# Altium project SC940D.PrjPcb (part 2 of 2)

## Sheet SC940D_STORRM.SchDoc: Sorties TOR Relais Monostable
size 393 x 270 mm; CompanyName: Seccom; Address1: 521, rue du capt. François Garbit; Address2: 69440 Mornant; Address3: seccom@seccom.fr; Address4: www.seccom.fr; DocumentNumber: 5; SheetNumber: 5; SheetTotal: 8; PageSetup: Record=PageOptions|CenterHorizontal=True|CenterVertical=True|PrintScale=0.74|XCorrection=1.00|YCorrection=1.00|PrintKind=0|BorderSize=5000000|LeftOffset=0|BottomOffset=0|Orientation=2|PaperLength=1000|PaperWidth=1000|Scale=100|PaperSource=7|PrintQuality=-4|MediaType=1|DitherType=10|PaperKind=A4|PrintScaleMode=1
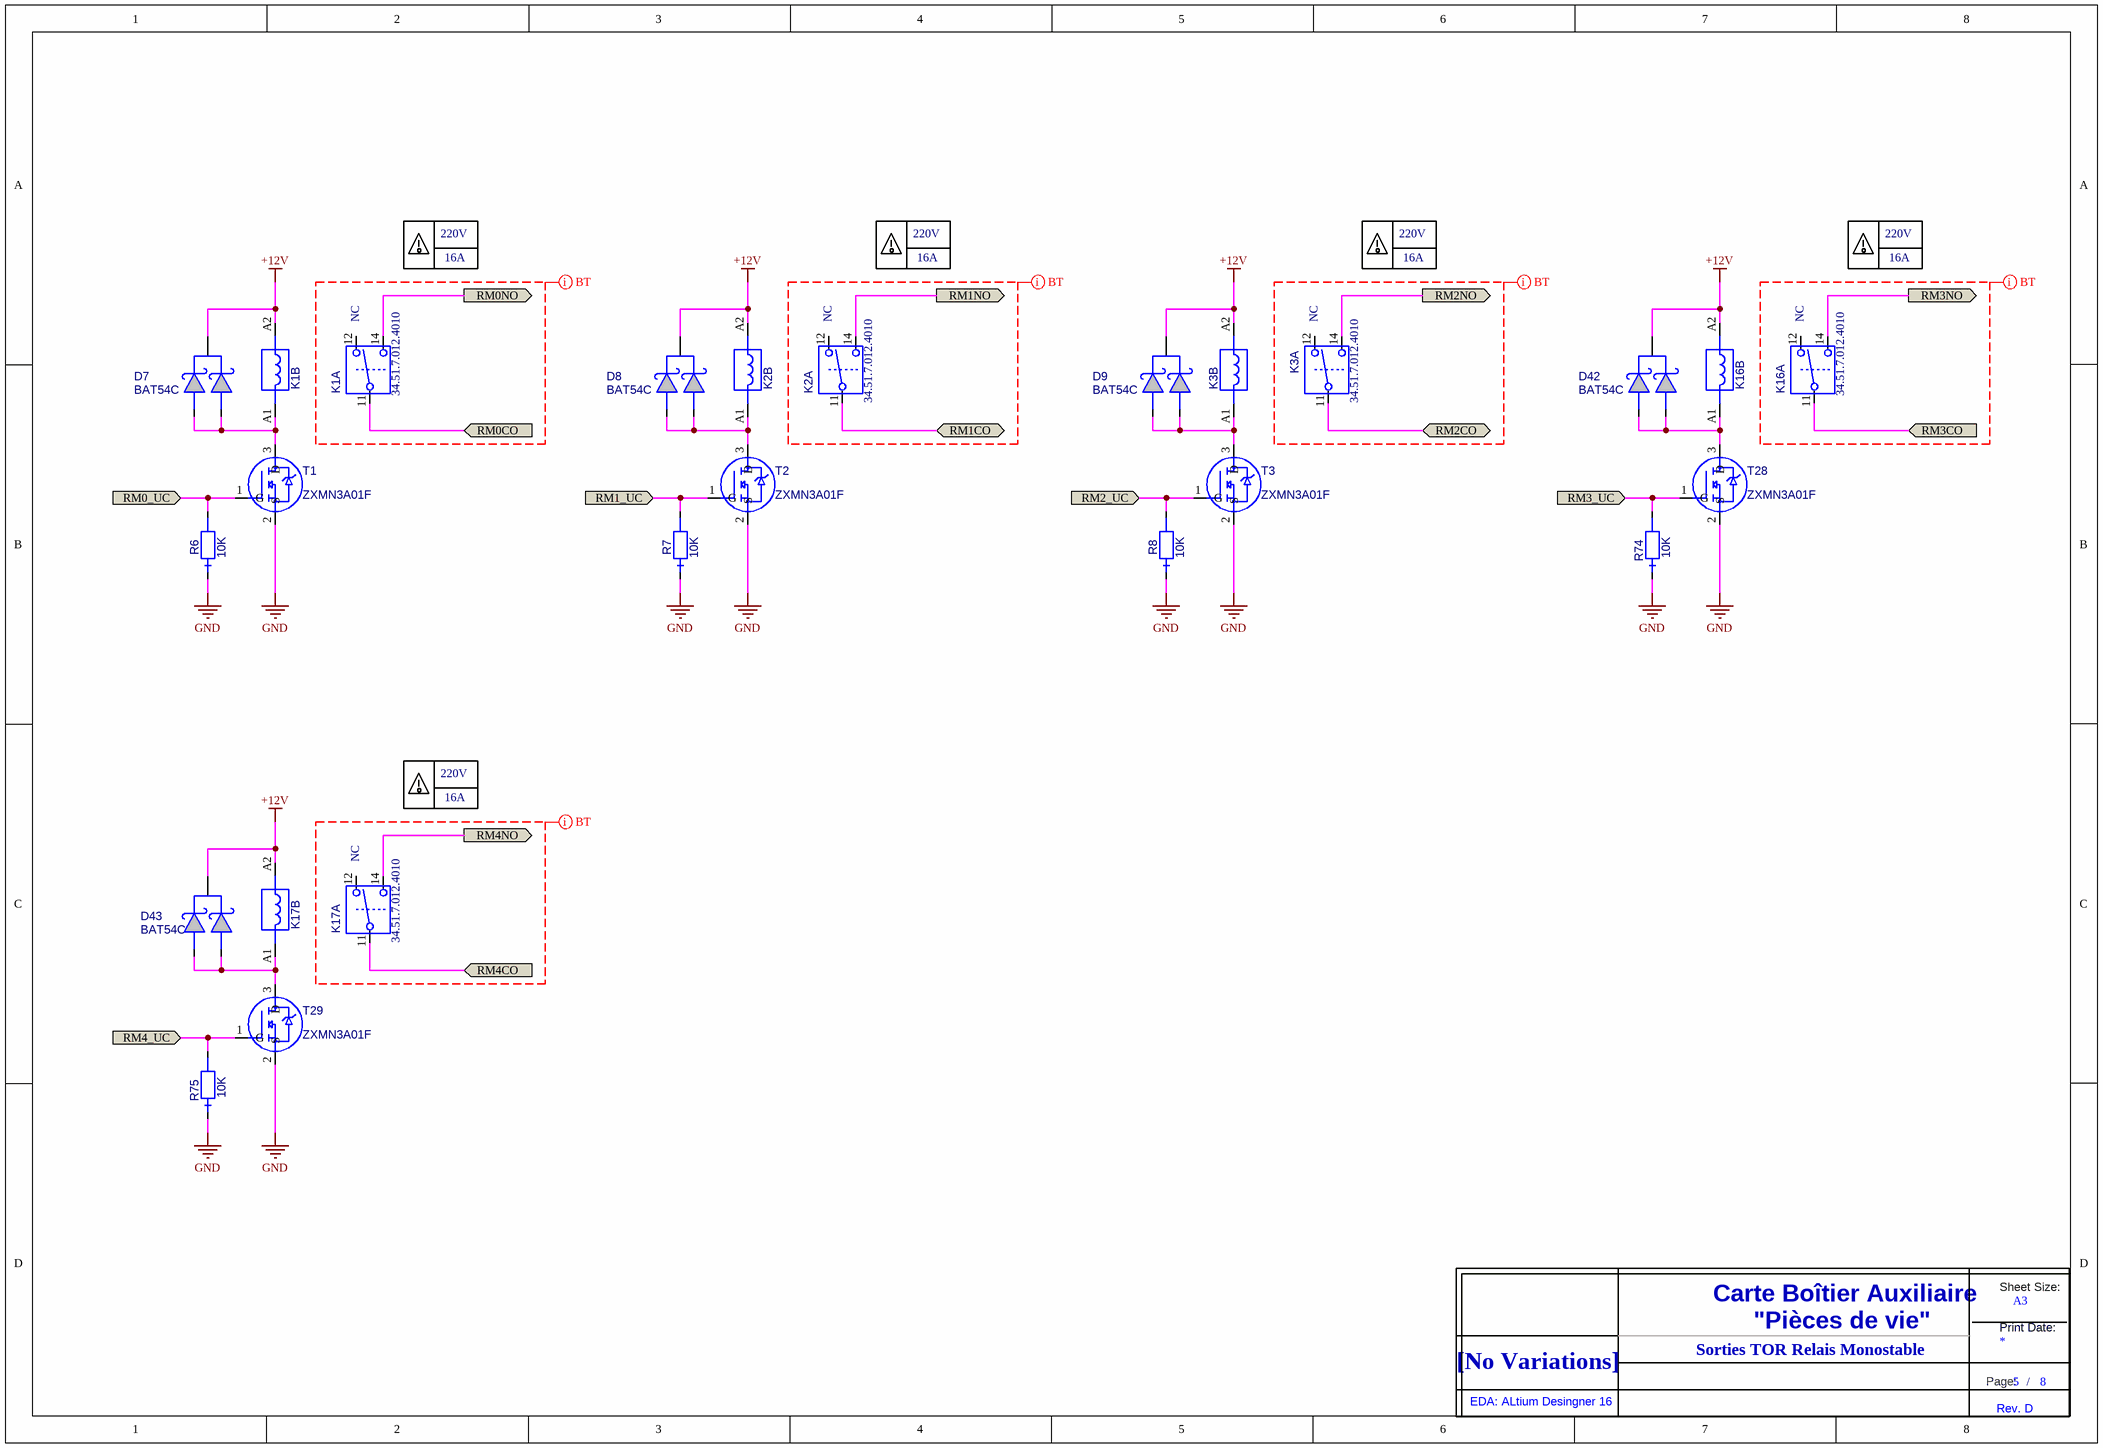
[diagram p5: SC940D_STORRM.SchDoc]

### Parts
(Parts that share a designator on the sheet are numbered #1, #2 ... from top to bottom, then left to right.)
D7  BAT54C  [SOT23_3L_ReflowSoldering]
D8  BAT54C  [SOT23_3L_ReflowSoldering]
D9  BAT54C  [SOT23_3L_ReflowSoldering]
D42  BAT54C  [SOT23_3L_ReflowSoldering]
D43  BAT54C  [SOT23_3L_ReflowSoldering]
K1  value 34.51.7.012.4010  [RELAY_FINDER_34.51_+SUPPORT_93]  (hidden comment: RELAY_12VDC_1RT_34.51)  (parts A,B of 2)
K2  RELAY_12VDC_1RT_34.51  [RELAY_FINDER_34.51_+SUPPORT_93]  (value not drawn)  (parts A,B of 2)
K3  value 34.51.7.012.4010  [RELAY_FINDER_34.51_+SUPPORT_93]  (hidden comment: RELAY_12VDC_1RT_34.51)  (parts A,B of 2)
K16  RELAY_12VDC_1RT_34.51  [RELAY_FINDER_34.51_+SUPPORT_93]  (value not drawn)  (parts A,B of 2)
K17  value 34.51.7.012.4010  [RELAY_FINDER_34.51_+SUPPORT_93]  (hidden comment: RELAY_12VDC_1RT_34.51)  (parts A,B of 2)
R6  value 10K  [0805_ReflowSoldering_RES]  (hidden comment: RES_0805_1%_100PPM_10K)
R7  value 10K  [0805_ReflowSoldering_RES]  (hidden comment: RES_0805_1%_100PPM_10K)
R8  value 10K  [0805_ReflowSoldering_RES]  (hidden comment: RES_0805_1%_100PPM_10K)
R74  value 10K  [0805_ReflowSoldering_RES]  (hidden comment: RES_0805_1%_100PPM_10K)
R75  value 10K  [0805_ReflowSoldering_RES]  (hidden comment: RES_0805_1%_100PPM_10K)
T1  ZXMN3A01F  [SOT23_3L_ReflowSoldering]
T2  ZXMN3A01F  [SOT23_3L_ReflowSoldering]
T3  ZXMN3A01F  [SOT23_3L_ReflowSoldering]
T28  ZXMN3A01F  [SOT23_3L_ReflowSoldering]
T29  ZXMN3A01F  [SOT23_3L_ReflowSoldering]
Title_new#5  DNI  (value not drawn)  (graphical)

### Ports
RM0_UC (in), RM0CO (in), RM0NO (out), RM1_UC (in), RM1CO, RM1NO (out), RM2_UC (in), RM2CO, RM2NO (out), RM3_UC (in), RM3CO (in), RM3NO (out), RM4_UC (in), RM4CO (in), RM4NO (out)

### Nets
+12V: D7.3 D8.3 D9.3 D42.3 D43.3 K1.A2 K2.A2 K3.A2 K16.A2 K17.A2
GND: R6.1 R7.1 R8.1 R74.1 R75.1 T1.2(S) T2.2(S) T3.2(S) T28.2(S) T29.2(S)
RM0_UC: R6.2 T1.1(G) ; port RM0_UC
RM0CO: K1.11(COM) ; port RM0CO
RM0NO: K1.14(NO) ; port RM0NO
RM1_UC: R7.2 T2.1(G) ; port RM1_UC
RM1CO: K2.11(COM) K3.11(COM) ; port RM1CO, port RM2CO
RM1NO: K2.14(NO) ; port RM1NO
RM2_UC: R8.2 T3.1(G) ; port RM2_UC
RM2NO: K3.14(NO) ; port RM2NO
RM3_UC: R74.2 T28.1(G) ; port RM3_UC
RM3CO: K16.11(COM) ; port RM3CO
RM3NO: K16.14(NO) ; port RM3NO
RM4_UC: R75.2 T29.1(G) ; port RM4_UC
RM4CO: K17.11(COM) ; port RM4CO
RM4NO: K17.14(NO) ; port RM4NO
NetD7_1: D7.1 D7.2 K1.A1 T1.3(D)
NetD8_1: D8.1 D8.2 K2.A1 T2.3(D)
NetD9_1: D9.1 D9.2 K3.A1 T3.3(D)
NetD42_1: D42.1 D42.2 K16.A1 T28.3(D)
NetD43_1: D43.1 D43.2 K17.A1 T29.3(D)

Not connected (* = marked no-connect by the designer): K1 12(NC); K2 12(NC); K3 12(NC); K16 12(NC); K17 12(NC)

### Layout directives
net class BT: (no net found under the mark)

### Notes on the sheet
- 220V
- (near K1) NC
- 16A
- (near K2) NC
- (near K3) NC
- (near K16) NC
- (near K17) NC
- Sorties TOR Relais Monostable
- (in symbol Title_new) Sheet Size:; Carte Boîtier Auxiliaire; A3; "Pièces de vie"; Print Date:; [No Variations]; Page:; /; EDA: ALtium Desingner 16; Rev. D

### Library data of the parts
D7-D9 D42 D43 = BAT54C: Diode Schottky double, BAT54 cathode com, Vrrm=30V, If=300mA, Vf=0.4Vmax, CMS; Creation: LJ (14/05/02); Reference: 000597/00; Boitier: SOT23_3L; Remarque: {Remarque}; Fabricant: NXP; Coeff: 1; Verification: LJ (14/05/02); Ref Fab: BAT54C; ComponentLink1URL: o:\_Documentation\Datasheets\NXP\BAT54_series.pdf; ComponentLink2URL: o:\_Documentation\Datasheets\_BOITIERS\ACTIF_CMS\SOT\SOT_23_3P_(Schneider).PDF; Config: *; ComponentLink1Description: Datasheet; ComponentLink2Description: Datasheet Boitier; Value: BAT54C; Supplier 1: Farnell; Supplier Part Number 1: 1081192
K1 K3 K17 = RELAY_12VDC_1RT_34.51: Relais 1RT, 12Vdc, série 34.51, Rc=1940R, Sw:250Vac/6A, Ron=? (AgSnO2); Creation: CHD; Verification: LJ (24/11/11); Boitier: DIP12 Form C; Remarque: {Remarque}; Fabricant: Finder; Coeff: 1; Ref Fab: 34.51.7.012.4010; ComponentLink1URL: o:\_Documentation\Datasheets\Finder\Relais_Serie_34.pdf; ComponentLink2URL: o:\_Documentation\Datasheets\_BOITIERS\; Config: *; ComponentLink1Description: Datasheet; ComponentLink2Description: Datasheet Boitier
K2 K16 = RELAY_12VDC_1RT_34.51: Relais 1RT, 12Vdc, série 34.51, Rc=1940R, Sw:250Vac/6A, Ron=? (AgSnO2); Creation: CHD; Verification: LJ (24/11/11); Boitier: DIP12 Form C; Remarque: {Remarque}; Fabricant: Finder; Ref Fab: 34.51.7.012.4010; Coeff: 1; Value: 34.51.7.012.4010; ComponentLink1URL: o:\_Documentation\Datasheets\Finder\Relais_Serie_34.pdf; ComponentLink2URL: o:\_Documentation\Datasheets\_BOITIERS\; Config: *; ComponentLink1Description: Datasheet; ComponentLink2Description: Datasheet Boitier
R6-R8 R74 R75 = RES_0805_1%_100PPM_10K: Résistance CMS 0805, 0.125W, 1%, 100ppm, 150V; Creation: LJ (06/02/09); Reference: 000063/00; Boitier: 0805; Remarque: {Remarque}; Fabricant: Yageo; Ref Fab: RC0805FR-0710KL; Coeff: 1; Verification: *; ComponentLink1URL: o:\_Documentation\Datasheets\BC_Components\Resistances_ThickFilmFlatChip_0402-0603-0805-1206.pdf; ComponentLink2URL: o:\_Documentation\Datasheets\_BOITIERS\PASSIF_CMS\RC_0805_(2x1,25)_(Schneider).PDF; Config: *; ComponentLink1Description: Datasheet; ComponentLink2Description: Datasheet Boitier; Supplier 1: Farnell; Supplier Part Number 1: 9237755
T1-T3 T28 T29 = ZXMN3A01F: Transistor MOSN logique, Vdss=30V, Id=2A, Rdson=0.12R, CMS; Boitier: SOT23_3L; Remarque: {Remarque}; Creation: CHD; Fabricant: Zetex; Coeff: 1; Ref Fab: ZXMN3A01F; ComponentLink1URL: o:\_Documentation\Datasheets\; ComponentLink2URL: o:\_Documentation\Datasheets\_BOITIERS\ACTIF_CMS\SOT\SOT_23_3P_(Schneider).PDF; Config: *; ComponentLink1Description: Datasheet; Value: ZXMN3A01F; Supplier 1: Farnell; Supplier 2: Mouser; Supplier Part Number 1: 9525734; Supplier Part Number 2: 522-ZXMN3A01FTA
Title_new#5 = Title_new

## Sheet SC940D_Variateurs.SchDoc: Variateurs
size 393 x 270 mm; CompanyName: Seccom; Address1: 521, rue du capt. François Garbit; Address2: 69440 Mornant; Address3: seccom@seccom.fr; Address4: www.seccom.fr; DocumentNumber: 6; SheetNumber: 6; SheetTotal: 8; PageSetup: Record=PageOptions|CenterHorizontal=True|CenterVertical=True|PrintScale=0.74|XCorrection=1.00|YCorrection=1.00|PrintKind=0|BorderSize=5000000|LeftOffset=0|BottomOffset=0|Orientation=2|PaperLength=1000|PaperWidth=1000|Scale=100|PaperSource=7|PrintQuality=-4|MediaType=1|DitherType=10|PaperKind=A4|PrintScaleMode=1
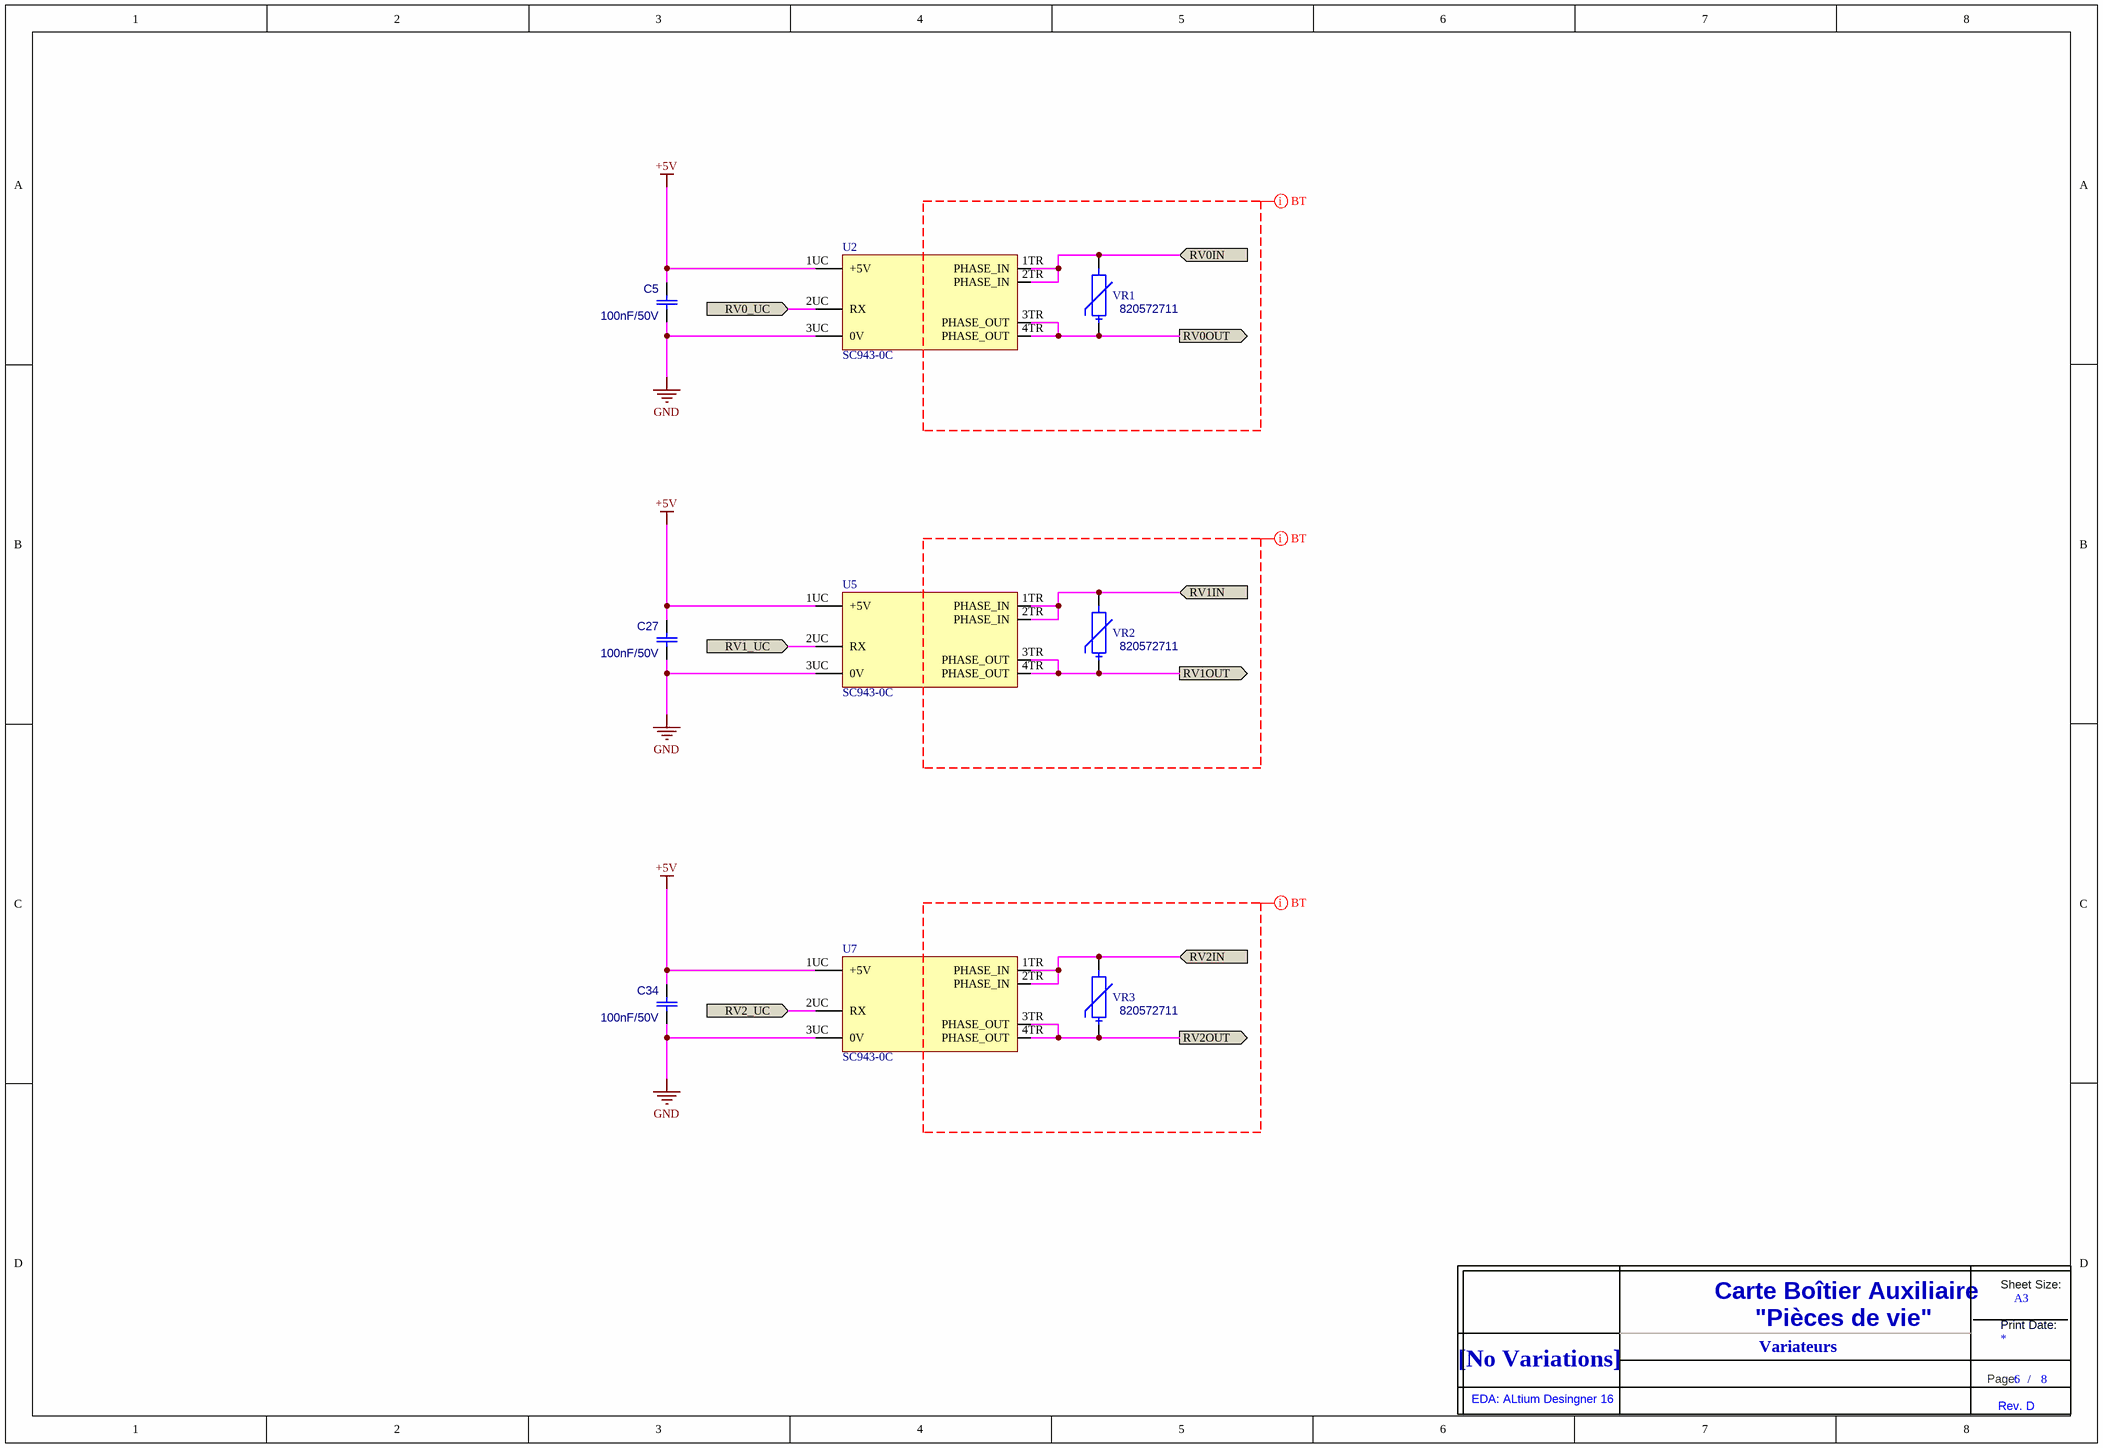
[diagram p6: SC940D_Variateurs.SchDoc]

### Parts
(Parts that share a designator on the sheet are numbered #1, #2 ... from top to bottom, then left to right.)
C5  value 100nF/50V  [0805_ReflowSoldering_CAP]  (hidden comment: C_0805_X7R_10%_100N-50V)
C27  value 100nF/50V  [0805_ReflowSoldering_CAP]  (hidden comment: C_0805_X7R_10%_100N-50V)
C34  value 100nF/50V  [0805_ReflowSoldering_CAP]  (hidden comment: C_0805_X7R_10%_100N-50V)
Title_new#6  DNI  (value not drawn)  (graphical)
U2  SC943-0C  [SI943C_REV_A]
U5  SC943-0C  [SI943C_REV_A]
U7  SC943-0C  [SI943C_REV_A]
VR1  value 820572711  [VDR_Serie_820_d7_h13_e5mm]  (hidden comment: VDR_820572711)
VR2  value 820572711  [VDR_Serie_820_d7_h13_e5mm]  (hidden comment: VDR_820572711)
VR3  value 820572711  [VDR_Serie_820_d7_h13_e5mm]  (hidden comment: VDR_820572711)

### Ports
RV0_UC (in), RV0IN (in), RV0OUT (out), RV1_UC (in), RV1IN (in), RV1OUT (out), RV2_UC (in), RV2IN (in), RV2OUT (out)

### Nets
+5V: C5.1 C27.1 C34.1 U2.1UC(+5V) U5.1UC(+5V) U7.1UC(+5V)
GND: C5.2 C27.2 C34.2 U2.3UC(0V) U5.3UC(0V) U7.3UC(0V)
RV0_UC: U2.2UC(RX) ; port RV0_UC
RV0IN: U2.1TR(PHASE_IN) U2.2TR(PHASE_IN) VR1.2 ; port RV0IN
RV0OUT: U2.3TR(PHASE_OUT) U2.4TR(PHASE_OUT) VR1.1 ; port RV0OUT
RV1_UC: U5.2UC(RX) ; port RV1_UC
RV1IN: U5.1TR(PHASE_IN) U5.2TR(PHASE_IN) VR2.2 ; port RV1IN
RV1OUT: U5.3TR(PHASE_OUT) U5.4TR(PHASE_OUT) VR2.1 ; port RV1OUT
RV2_UC: U7.2UC(RX) ; port RV2_UC
RV2IN: U7.1TR(PHASE_IN) U7.2TR(PHASE_IN) VR3.2 ; port RV2IN
RV2OUT: U7.3TR(PHASE_OUT) U7.4TR(PHASE_OUT) VR3.1 ; port RV2OUT

### Layout directives
net class BT: (no net found under the mark)

### Notes on the sheet
- Variateurs
- (in symbol Title_new) Sheet Size:; Carte Boîtier Auxiliaire; A3; "Pièces de vie"; Print Date:; [No Variations]; Page:; /; EDA: ALtium Desingner 16; Rev. D

### Library data of the parts
C5 C27 C34 = C_0805_X7R_10%_100N-50V: Condensateur céramique, X7R, 10%, CMS 0805; Creation: LJ; Verification: LJ (28/05/04); Reference: 000042/00; Boitier: 0805; Remarque: {Remarque}; Fabricant: AVX; Ref Fab: 08055C104KAT2A; Coeff: 1; ComponentLink1URL: o:\_Documentation\Datasheets\BC_Components\Condo_CMS_NPO-X7R-Y5V.pdf; ComponentLink2URL: o:\_Documentation\Datasheets\_BOITIERS\PASSIF_CMS\RC_0805_(2x1,25)_(Schneider).PDF; Config: *; ComponentLink1Description: Datasheet; ComponentLink2Description: Datasheet Boitier; Supplier 1: Farnell; Supplier Part Number 1: 499687
Title_new#6 = Title_new
U2 U5 U7 = SC943-0C: Carte gradateur; Boitier: SI943C; Coeff: 1; Fabricant: Valentinéa; Remarque: {Remarque}; Ref Fab: SC943-0C; Value: SC943-0C
VR1-VR3 = VDR_820572711: Varistance disque 275Vac, 350Vdc, 33J, Vbreak=430V@1mA, Vclamp=710V@10A, Ipeak=1200A; Creation: LJ (12/01/12); Reference: {Reference}; Boitier: d7_t4.6_h13_e5mm; Remarque: {Remarque}; Fabricant: Wurth Elektronik; Coeff: 1; Ref Fab: 820572711; ComponentLink1URL: o:\_Documentation\Datasheets\Wurth_Elektronik\Varistance_820572711.pdf; ComponentLink2URL: o:\_Documentation\Datasheets\; Config: *; ComponentLink1Description: Datasheet; ComponentLink2Description: Datasheet Boitier

## Sheet SC940D_STORRB.SchDoc: Sorties TOR Relais Bistable
size 393 x 270 mm; CompanyName: Seccom; Address1: 521, rue du capt. François Garbit; Address2: 69440 Mornant; Address3: seccom@seccom.fr; Address4: www.seccom.fr; DocumentNumber: 7; SheetNumber: 7; SheetTotal: 8; PageSetup: Record=PageOptions|CenterHorizontal=True|CenterVertical=True|PrintScale=0.74|XCorrection=1.00|YCorrection=1.00|PrintKind=0|BorderSize=5000000|LeftOffset=0|BottomOffset=0|Orientation=2|PaperLength=1000|PaperWidth=1000|Scale=100|PaperSource=7|PrintQuality=-4|MediaType=1|DitherType=10|PaperKind=A4|PrintScaleMode=1
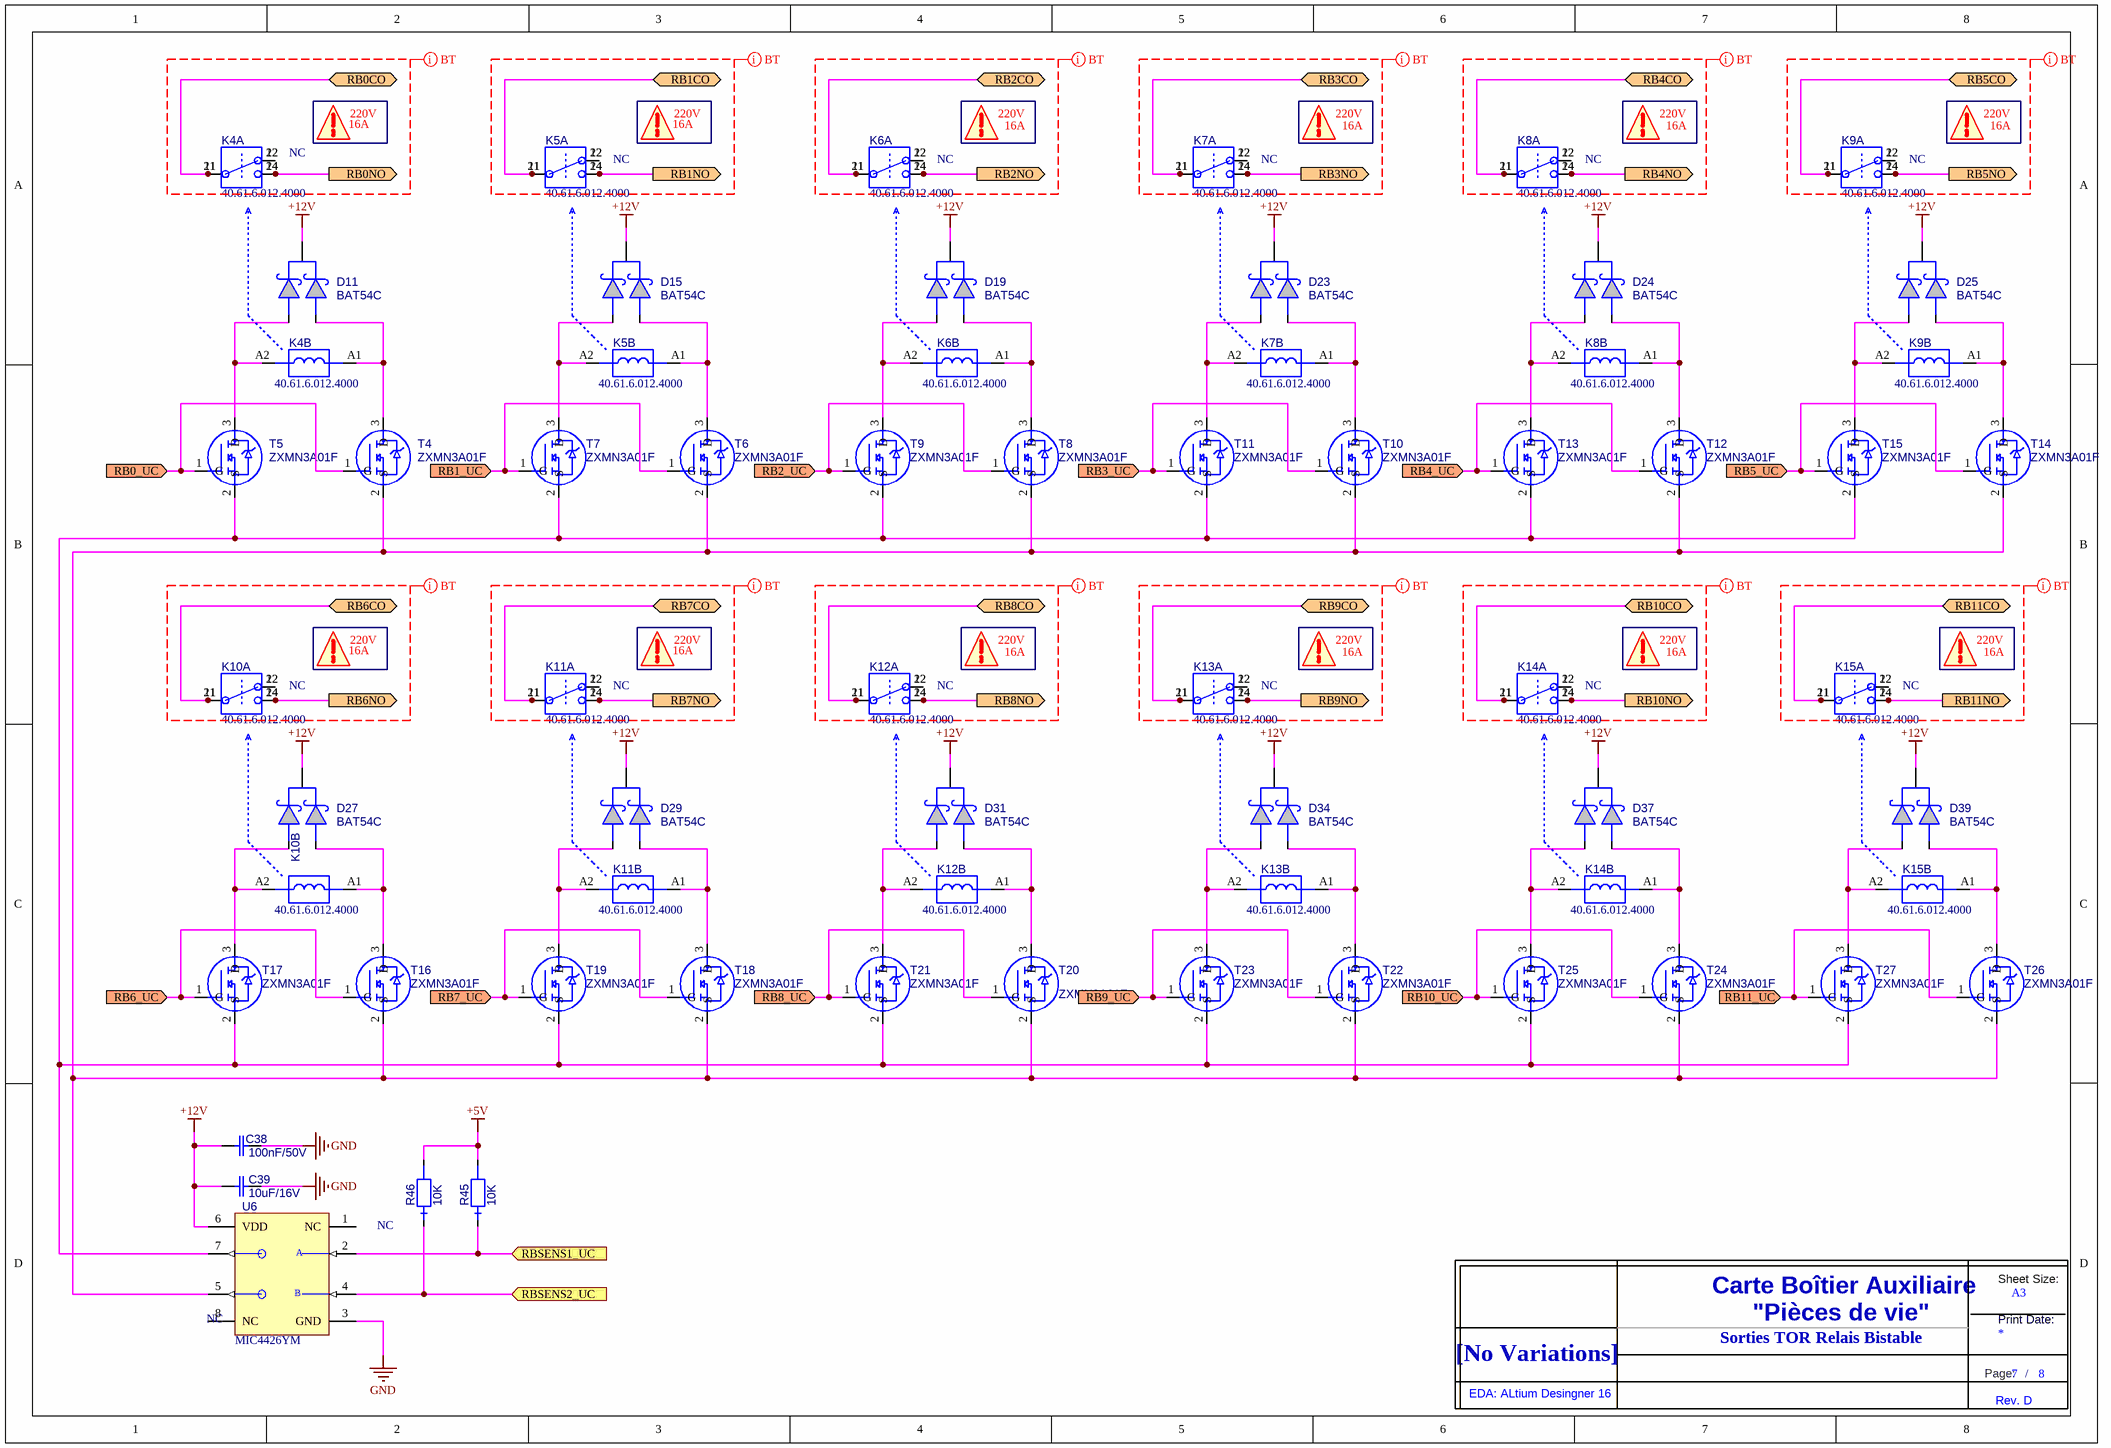
[diagram p7: SC940D_STORRB.SchDoc]

### Parts
(Parts that share a designator on the sheet are numbered #1, #2 ... from top to bottom, then left to right.)
C38  value 100nF/50V  [0805_ReflowSoldering_CAP]  (hidden comment: C_0805_X7R_10%_100N-50V)
C39  value 10uF/16V  [0805_ReflowSoldering_CAP]  (hidden comment: C_0805_X5R_10%_10U-16V)
D11  BAT54C  [SOT23_3L_ReflowSoldering]
D15  BAT54C  [SOT23_3L_ReflowSoldering]
D19  BAT54C  [SOT23_3L_ReflowSoldering]
D23  BAT54C  [SOT23_3L_ReflowSoldering]
D24  BAT54C  [SOT23_3L_ReflowSoldering]
D25  BAT54C  [SOT23_3L_ReflowSoldering]
D27  BAT54C  [SOT23_3L_ReflowSoldering]
D29  BAT54C  [SOT23_3L_ReflowSoldering]
D31  BAT54C  [SOT23_3L_ReflowSoldering]
D34  BAT54C  [SOT23_3L_ReflowSoldering]
D37  BAT54C  [SOT23_3L_ReflowSoldering]
D39  BAT54C  [SOT23_3L_ReflowSoldering]
K4  value 40.61.6.012.4000  [RELAY_FINDER_40.61_+SUPPORT_95]  (hidden comment: RELAY_12VDC_1RT_BI_40.61.6)  (parts A,B of 2)
K5  value 40.61.6.012.4000  [RELAY_FINDER_40.61_+SUPPORT_95]  (hidden comment: RELAY_12VDC_1RT_BI_40.61.6)  (parts A,B of 2)
K6  value 40.61.6.012.4000  [RELAY_FINDER_40.61_+SUPPORT_95]  (hidden comment: RELAY_12VDC_1RT_BI_40.61.6)  (parts A,B of 2)
K7  value 40.61.6.012.4000  [RELAY_FINDER_40.61_+SUPPORT_95]  (hidden comment: RELAY_12VDC_1RT_BI_40.61.6)  (parts A,B of 2)
K8  value 40.61.6.012.4000  [RELAY_FINDER_40.61_+SUPPORT_95]  (hidden comment: RELAY_12VDC_1RT_BI_40.61.6)  (parts A,B of 2)
K9  value 40.61.6.012.4000  [RELAY_FINDER_40.61_+SUPPORT_95]  (hidden comment: RELAY_12VDC_1RT_BI_40.61.6)  (parts A,B of 2)
K10  value 40.61.6.012.4000  [RELAY_FINDER_40.61_+SUPPORT_95]  (hidden comment: RELAY_12VDC_1RT_BI_40.61.6)  (parts A,B of 2)
K11  value 40.61.6.012.4000  [RELAY_FINDER_40.61_+SUPPORT_95]  (hidden comment: RELAY_12VDC_1RT_BI_40.61.6)  (parts A,B of 2)
K12  value 40.61.6.012.4000  [RELAY_FINDER_40.61_+SUPPORT_95]  (hidden comment: RELAY_12VDC_1RT_BI_40.61.6)  (parts A,B of 2)
K13  value 40.61.6.012.4000  [RELAY_FINDER_40.61_+SUPPORT_95]  (hidden comment: RELAY_12VDC_1RT_BI_40.61.6)  (parts A,B of 2)
K14  value 40.61.6.012.4000  [RELAY_FINDER_40.61_+SUPPORT_95]  (hidden comment: RELAY_12VDC_1RT_BI_40.61.6)  (parts A,B of 2)
K15  value 40.61.6.012.4000  [RELAY_FINDER_40.61_+SUPPORT_95]  (hidden comment: RELAY_12VDC_1RT_BI_40.61.6)  (parts A,B of 2)
R45  value 10K  [0805_ReflowSoldering_RES]  (hidden comment: RES_0805_1%_100PPM_10K)
R46  value 10K  [0805_ReflowSoldering_RES]  (hidden comment: RES_0805_1%_100PPM_10K)
T4  ZXMN3A01F  [SOT23_3L_ReflowSoldering]
T5  ZXMN3A01F  [SOT23_3L_ReflowSoldering]
T6  ZXMN3A01F  [SOT23_3L_ReflowSoldering]
T7  ZXMN3A01F  [SOT23_3L_ReflowSoldering]
T8  ZXMN3A01F  [SOT23_3L_ReflowSoldering]
T9  ZXMN3A01F  [SOT23_3L_ReflowSoldering]
T10  ZXMN3A01F  [SOT23_3L_ReflowSoldering]
T11  ZXMN3A01F  [SOT23_3L_ReflowSoldering]
T12  ZXMN3A01F  [SOT23_3L_ReflowSoldering]
T13  ZXMN3A01F  [SOT23_3L_ReflowSoldering]
T14  ZXMN3A01F  [SOT23_3L_ReflowSoldering]
T15  ZXMN3A01F  [SOT23_3L_ReflowSoldering]
T16  ZXMN3A01F  [SOT23_3L_ReflowSoldering]
T17  ZXMN3A01F  [SOT23_3L_ReflowSoldering]
T18  ZXMN3A01F  [SOT23_3L_ReflowSoldering]
T19  ZXMN3A01F  [SOT23_3L_ReflowSoldering]
T20  ZXMN3A01F  [SOT23_3L_ReflowSoldering]
T21  ZXMN3A01F  [SOT23_3L_ReflowSoldering]
T22  ZXMN3A01F  [SOT23_3L_ReflowSoldering]
T23  ZXMN3A01F  [SOT23_3L_ReflowSoldering]
T24  ZXMN3A01F  [SOT23_3L_ReflowSoldering]
T25  ZXMN3A01F  [SOT23_3L_ReflowSoldering]
T26  ZXMN3A01F  [SOT23_3L_ReflowSoldering]
T27  ZXMN3A01F  [SOT23_3L_ReflowSoldering]
Title_new#7  DNI  (value not drawn)  (graphical)
U6  MIC4426YM  [SOIC_08_E1,27_L150_ReflowSoldering]

### Ports
RB0_UC (in), RB0CO, RB0NO (out), RB1_UC (in), RB1CO, RB1NO (out), RB2_UC (in), RB2CO, RB2NO (out), RB3_UC (in), RB3CO, RB3NO (out), RB4_UC (in), RB4CO, RB4NO (out), RB5_UC (in), RB5CO, RB5NO (out), RB6_UC (in), RB6CO, RB6NO (out), RB7_UC (in), RB7CO, RB7NO (out), RB8_UC (in), RB8CO, RB8NO (out), RB9_UC (in), RB9CO, RB9NO (out), RB10_UC (in), RB10CO, RB10NO (out), RB11_UC (in), RB11CO, RB11NO (out), RBSENS1_UC (in), RBSENS2_UC (in)

### Nets
+5V: R45.2 R46.2
+12V: C38.1 C39.2 D11.3 D15.3 D19.3 D23.3 D24.3 D25.3 D27.3 D29.3 D31.3 D34.3 D37.3 D39.3 U6.6(VDD)
GND: C38.2 C39.1 U6.3(GND)
RB0_UC: T4.1(G) T5.1(G) ; port RB0_UC
RB0CO: K4.11(COM) K4.21(COM) K5.11(COM) K5.21(COM) K6.11(COM) K6.21(COM) K7.11(COM) K7.21(COM) K8.11(COM) K8.21(COM) K9.11(COM) K9.21(COM) ; port RB0CO, port RB1CO, port RB2CO, port RB3CO, port RB4CO, port RB5CO
RB0NO: K4.14(NO) K4.24(NO) ; port RB0NO
RB1_UC: T6.1(G) T7.1(G) ; port RB1_UC
RB1NO: K5.14(NO) K5.24(NO) ; port RB1NO
RB2_UC: T8.1(G) T9.1(G) ; port RB2_UC
RB2NO: K6.14(NO) K6.24(NO) ; port RB2NO
RB3_UC: T10.1(G) T11.1(G) ; port RB3_UC
RB3NO: K7.14(NO) K7.24(NO) ; port RB3NO
RB4_UC: T12.1(G) T13.1(G) ; port RB4_UC
RB4NO: K8.14(NO) K8.24(NO) ; port RB4NO
RB5_UC: T14.1(G) T15.1(G) ; port RB5_UC
RB5NO: K9.14(NO) K9.24(NO) ; port RB5NO
RB6_UC: T16.1(G) T17.1(G) ; port RB6_UC
RB6CO: K10.11(COM) K10.21(COM) K11.11(COM) K11.21(COM) K12.11(COM) K12.21(COM) K13.11(COM) K13.21(COM) ; port RB6CO, port RB7CO, port RB8CO, port RB9CO
RB6NO: K10.14(NO) K10.24(NO) ; port RB6NO
RB7_UC: T18.1(G) T19.1(G) ; port RB7_UC
RB7NO: K11.14(NO) K11.24(NO) ; port RB7NO
RB8_UC: T20.1(G) T21.1(G) ; port RB8_UC
RB8NO: K12.14(NO) K12.24(NO) ; port RB8NO
RB9_UC: T22.1(G) T23.1(G) ; port RB9_UC
RB9NO: K13.14(NO) K13.24(NO) ; port RB9NO
RB10_UC: T24.1(G) T25.1(G) ; port RB10_UC
RB10CO: K14.11(COM) K14.21(COM) K15.11(COM) K15.21(COM) ; port RB10CO, port RB11CO
RB10NO: K14.14(NO) K14.24(NO) ; port RB10NO
RB11_UC: T26.1(G) T27.1(G) ; port RB11_UC
RB11NO: K15.14(NO) K15.24(NO) ; port RB11NO
RBSENS1_UC: R45.1 U6.2(INA) ; port RBSENS1_UC
RBSENS2_UC: R46.1 U6.4(INB) ; port RBSENS2_UC
NetD11_1: D11.1 K4.A1 T4.3(D)
NetD11_2: D11.2 K4.A2 T5.3(D)
NetD15_1: D15.1 K5.A1 T6.3(D)
NetD15_2: D15.2 K5.A2 T7.3(D)
NetD19_1: D19.1 K6.A1 T8.3(D)
NetD19_2: D19.2 K6.A2 T9.3(D)
NetD23_1: D23.1 K7.A1 T10.3(D)
NetD23_2: D23.2 K7.A2 T11.3(D)
NetD24_1: D24.1 K8.A1 T12.3(D)
NetD24_2: D24.2 K8.A2 T13.3(D)
NetD25_1: D25.1 K9.A1 T14.3(D)
NetD25_2: D25.2 K9.A2 T15.3(D)
NetD27_1: D27.1 K10.A1 T16.3(D)
NetD27_2: D27.2 K10.A2 T17.3(D)
NetD29_1: D29.1 K11.A1 T18.3(D)
NetD29_2: D29.2 K11.A2 T19.3(D)
NetD31_1: D31.1 K12.A1 T20.3(D)
NetD31_2: D31.2 K12.A2 T21.3(D)
NetD34_1: D34.1 K13.A1 T22.3(D)
NetD34_2: D34.2 K13.A2 T23.3(D)
NetD37_1: D37.1 K14.A1 T24.3(D)
NetD37_2: D37.2 K14.A2 T25.3(D)
NetD39_1: D39.1 K15.A1 T26.3(D)
NetD39_2: D39.2 K15.A2 T27.3(D)
NetK4_12: K4.12(NC) K4.22(NC)
NetK5_12: K5.12(NC) K5.22(NC)
NetK6_12: K6.12(NC) K6.22(NC)
NetK7_12: K7.12(NC) K7.22(NC)
NetK8_12: K8.12(NC) K8.22(NC)
NetK9_12: K9.12(NC) K9.22(NC)
NetK10_12: K10.12(NC) K10.22(NC)
NetK11_12: K11.12(NC) K11.22(NC)
NetK12_12: K12.12(NC) K12.22(NC)
NetK13_12: K13.12(NC) K13.22(NC)
NetK14_12: K14.12(NC) K14.22(NC)
NetK15_12: K15.12(NC) K15.22(NC)
NetT4_2: T4.2(S) T6.2(S) T8.2(S) T10.2(S) T12.2(S) T14.2(S) T16.2(S) T18.2(S) T20.2(S) T22.2(S) T24.2(S) T26.2(S) U6.5(~{OUTB})
NetT5_2: T5.2(S) T7.2(S) T9.2(S) T11.2(S) T13.2(S) T15.2(S) T17.2(S) T19.2(S) T21.2(S) T23.2(S) T25.2(S) T27.2(S) U6.7(~{OUTA})

Not connected (* = marked no-connect by the designer): U6 1(NC) 8(NC)

### Layout directives
net class BT: (no net found under the mark)

### Notes on the sheet
- 220V
- (near K4) NC
- 16A
- (near K5) NC
- (near K6) NC
- (near K7) NC
- (near K8) NC
- (near K9) NC
- (near K10) NC
- (near K11) NC
- (near K12) NC
- (near K13) NC
- (near K14) NC
- (near K15) NC
- NC
- (near U6) NC
- Sorties TOR Relais Bistable
- (in symbol MIC4426YM) A; B
- (in symbol Title_new) Sheet Size:; Carte Boîtier Auxiliaire; A3; "Pièces de vie"; Print Date:; [No Variations]; Page:; /; EDA: ALtium Desingner 16; Rev. D

### Library data of the parts
C38 = C_0805_X7R_10%_100N-50V: as C5 on sheet SC940D_Variateurs; ComponentLink1URL: o:\_Documentation\Datasheets\BC_Components\Condo_CMS_NPO-X7R-Y5V.pdf; ComponentLink2URL: o:\_Documentation\Datasheets\_BOITIERS\PASSIF_CMS\RC_0805_(2x1,25)_(Schneider).PDF; Config: *; ComponentLink1Description: Datasheet; ComponentLink2Description: Datasheet Boitier; Supplier 1: Farnell; Supplier Part Number 1: 499687
C39 = C_0805_X5R_10%_10U-16V: Condensateur céramique, X5R, 10%, CMS 0805; Creation: LJ (12/09/11); Reference: 001715/00; Boitier: 0805; Remarque: {Remarque}; Coeff: 1; Fabricant: Murata; Ref Fab: GRM219R61C106KA73D; Verification: *; ComponentLink1URL: o:\_Documentation\Datasheets\; ComponentLink2URL: o:\_Documentation\Datasheets\_Boitiers\PASSIF_CMS\RC_0805_(2x1,25)_(Schneider).pdf; Config: *; ComponentLink1Description: Datasheet; ComponentLink2Description: Datasheet Boitier
D11 D15 D19 D23-D25 D27 D29 D31 D34 D37 D39 = BAT54C: as D7 on sheet SC940D_STORRM; Verification: LJ (14/05/02); Ref Fab: BAT54C; ComponentLink1URL: o:\_Documentation\Datasheets\NXP\BAT54_series.pdf; ComponentLink2URL: o:\_Documentation\Datasheets\_BOITIERS\ACTIF_CMS\SOT\SOT_23_3P_(Schneider).PDF; Config: *; ComponentLink1Description: Datasheet; ComponentLink2Description: Datasheet Boitier; Value: BAT54C; Supplier 1: Farnell; Supplier Part Number 1: 1081192
K4-K15 = RELAY_12VDC_1RT_BI_40.61.6: Relais 1RT, 12Vdc, série 40.61.6 (bistable), Rc=900R, Sw:250Vac/16A, Ron=? (AgSnO2); Creation: CHD; Verification: LJ (24/11/11); Boitier: type DIP16; Remarque: {Remarque}; Fabricant: Finder; Coeff: 1; Ref Fab: 40.61.6.012.4000; ComponentLink1URL: o:\_Documentation\Datasheets\Finder\Relais_Serie_40.pdf; ComponentLink2URL: o:\_Documentation\Datasheets\_BOITIERS\; Config: *; ComponentLink1Description: Datasheet; ComponentLink2Description: Datasheet Boitier
R45 R46 = RES_0805_1%_100PPM_10K: as R6 on sheet SC940D_STORRM; Verification: *; ComponentLink1URL: o:\_Documentation\Datasheets\BC_Components\Resistances_ThickFilmFlatChip_0402-0603-0805-1206.pdf; ComponentLink2URL: o:\_Documentation\Datasheets\_BOITIERS\PASSIF_CMS\RC_0805_(2x1,25)_(Schneider).PDF; Config: *; ComponentLink1Description: Datasheet; ComponentLink2Description: Datasheet Boitier; Supplier 1: Farnell; Supplier Part Number 1: 9237755
T4-T27 = ZXMN3A01F: as T1 on sheet SC940D_STORRM; Ref Fab: ZXMN3A01F; ComponentLink1URL: o:\_Documentation\Datasheets\; ComponentLink2URL: o:\_Documentation\Datasheets\_BOITIERS\ACTIF_CMS\SOT\SOT_23_3P_(Schneider).PDF; Config: *; ComponentLink1Description: Datasheet; Value: ZXMN3A01F; Supplier 1: Farnell; Supplier 2: Mouser; Supplier Part Number 1: 9525734; Supplier Part Number 2: 522-ZXMN3A01FTA
Title_new#7 = Title_new
U6 = MIC4426YM: Dual High-Speed 1.5A MOSFET Driver, CMS; Creation: CHD; Verification: LJ (); Boitier: SO8_L150; Remarque: {Remarque}; Fabricant: Micrel; Coeff: 1; Ref Fab: MIC4426YM; ComponentLink1URL: o:\_Documentation\Datasheets\; ComponentLink2URL: o:\_Documentation\Datasheets\_Boitiers\ACTIF_CMS\SOIC\SOIC_08_e1,27_L150_(Schneider).PDF; Config: *; ComponentLink1Description: Datasheet; ComponentLink2Description: Datasheet Boitier; Value: MIC4426YM

## Sheet SC940D_Borniers.SchDoc: Borniers
size 393 x 270 mm; CompanyName: Seccom; Address1: 521, rue du capt. François Garbit; Address2: 69440 Mornant; Address3: seccom@seccom.fr; Address4: www.seccom.fr; DocumentNumber: 8; SheetNumber: 8; SheetTotal: 8; PageSetup: Record=PageOptions|CenterHorizontal=True|CenterVertical=True|PrintScale=0.74|XCorrection=1.00|YCorrection=1.00|PrintKind=0|BorderSize=5000000|LeftOffset=0|BottomOffset=0|Orientation=2|PaperLength=1000|PaperWidth=1000|Scale=100|PaperSource=7|PrintQuality=-4|MediaType=1|DitherType=10|PaperKind=A4|PrintScaleMode=1
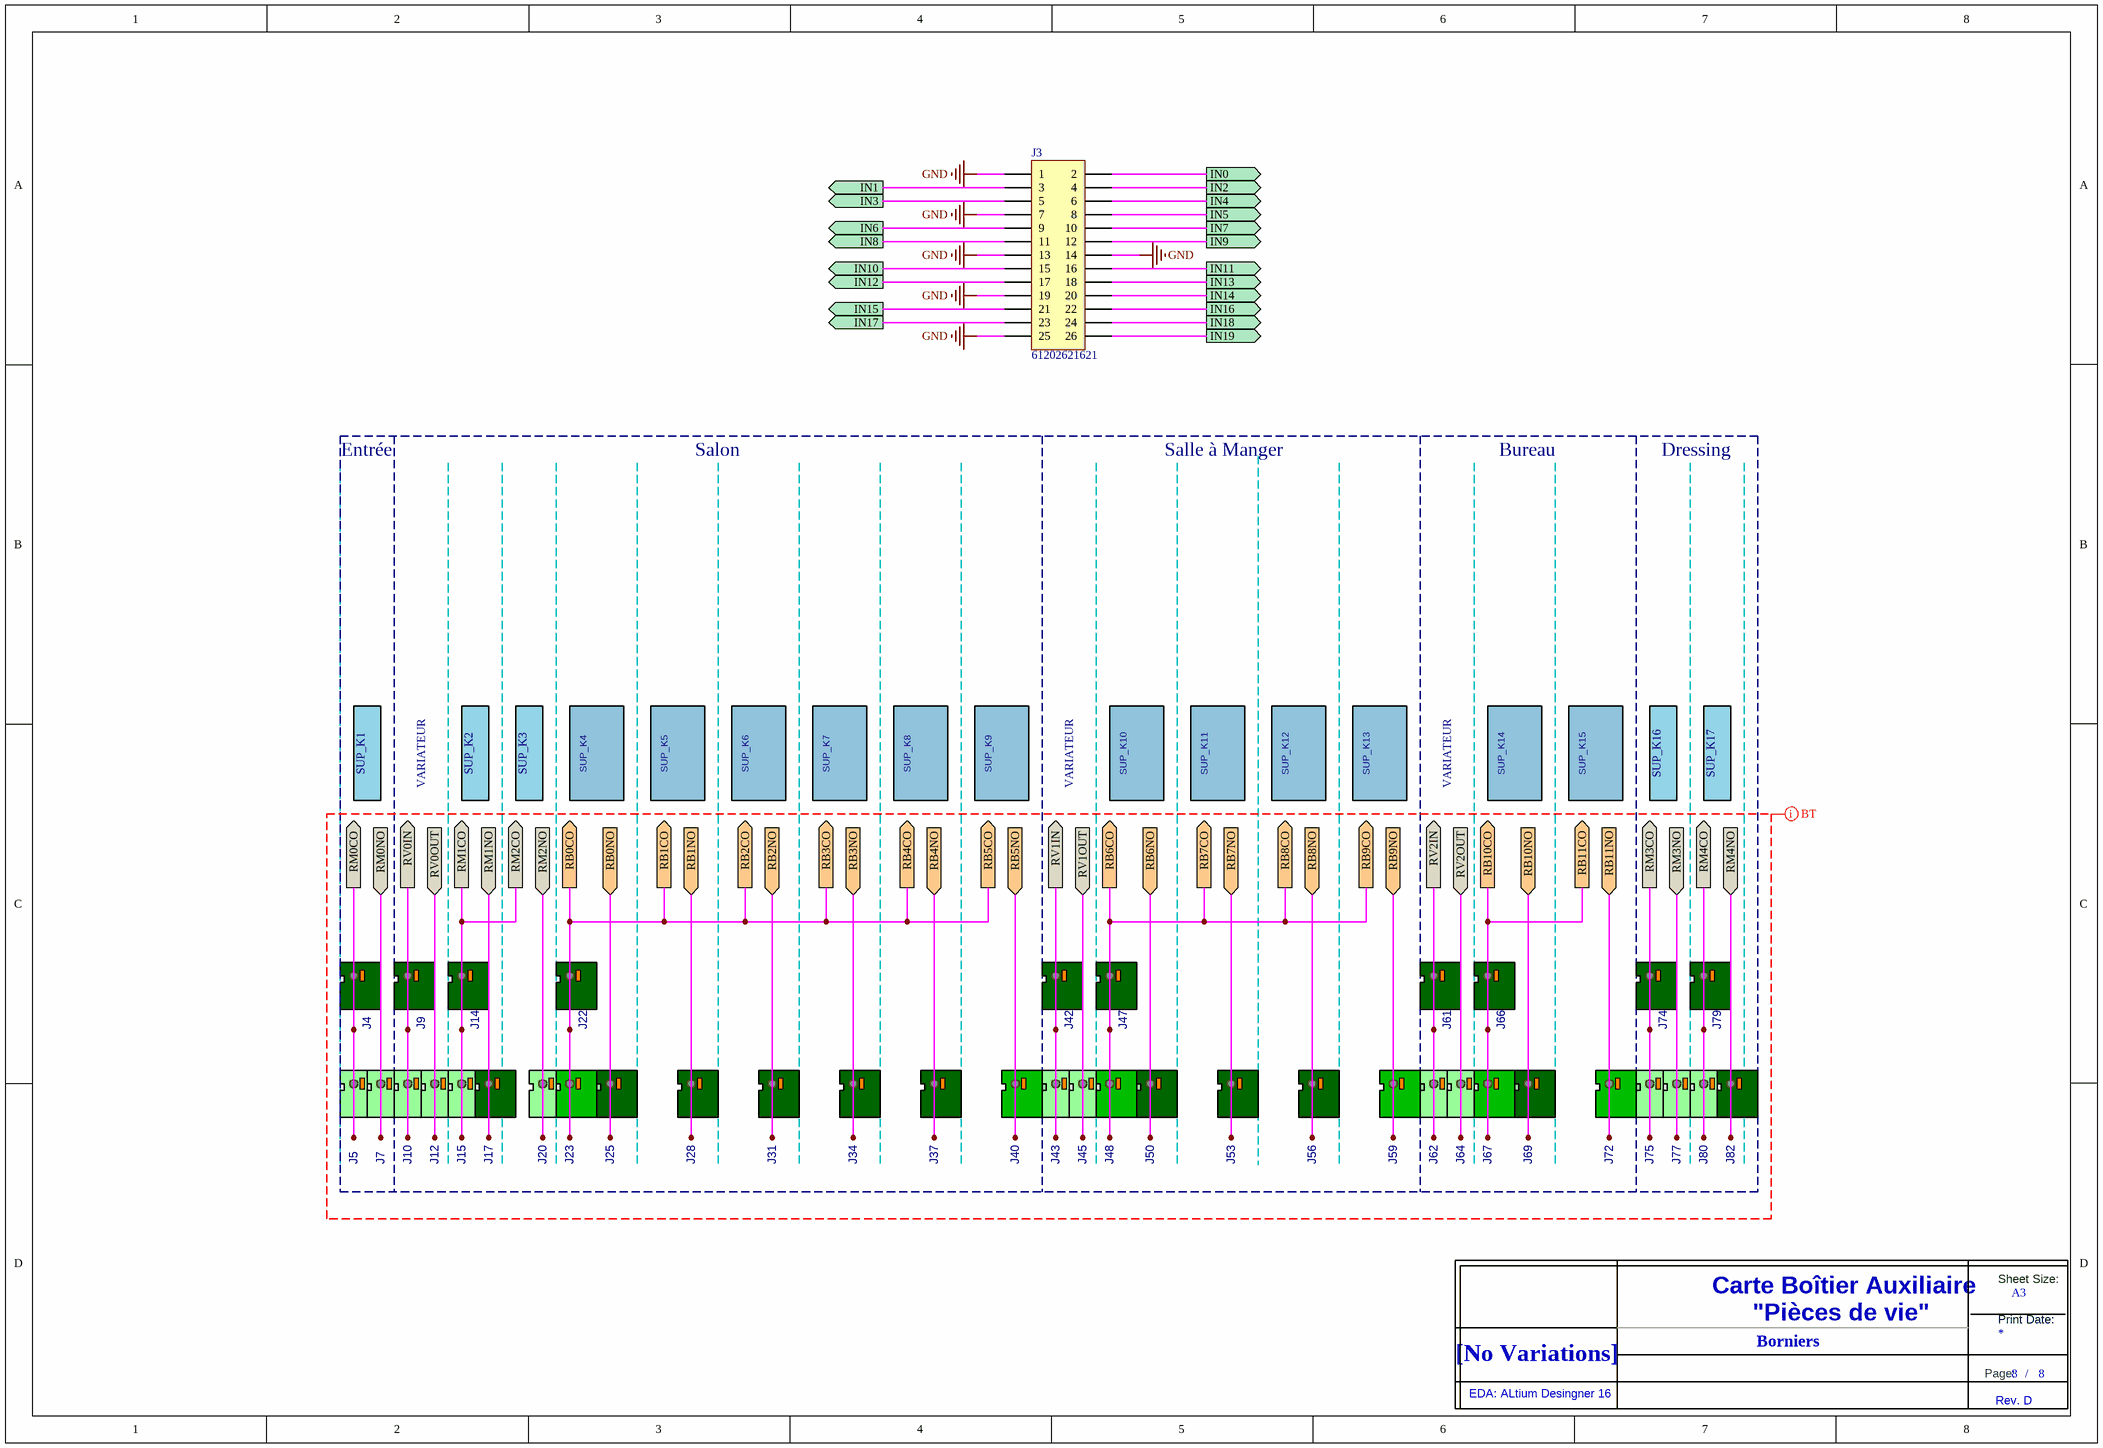
[diagram p8: SC940D_Borniers.SchDoc]

### Parts
(Parts that share a designator on the sheet are numbered #1, #2 ... from top to bottom, then left to right.)
J3  61202621621  [IDC2P54_26P]
J4  BRESS_CI_D_7.62_01_FFKDSA1/V2  [BRESS_FFKDSA1/V2-7,62_P1.3]  (value not drawn)
J5  BRESS_CI_D_5.08_01_FFKDS/V2  [BRESS_FFKDS/V2-5,08_P1.3]  (value not drawn)
J7  BRESS_CI_D_5.08_01_FFKDS/V2  [BRESS_FFKDS/V2-5,08_P1.3]  (value not drawn)
J9  BRESS_CI_D_7.62_01_FFKDSA1/V2  [BRESS_FFKDSA1/V2-7,62_P1.3]  (value not drawn)
J10  BRESS_CI_D_5.08_01_FFKDS/V2  [BRESS_FFKDS/V2-5,08_P1.3]  (value not drawn)
J12  BRESS_CI_D_5.08_01_FFKDS/V2  [BRESS_FFKDS/V2-5,08_P1.3]  (value not drawn)
J14  BRESS_CI_D_7.62_01_FFKDSA1/V2  [BRESS_FFKDSA1/V2-7,62_P1.3]  (value not drawn)
J15  BRESS_CI_D_5.08_01_FFKDS/V2  [BRESS_FFKDS/V2-5,08_P1.3]  (value not drawn)
J17  BRESS_CI_D_7.62_01_FFKDSA1/V2  [BRESS_FFKDSA1/V2-7,62_P1.3]  (value not drawn)
J20  BRESS_CI_D_5.08_01_FFKDS/V2  [BRESS_FFKDS/V2-5,08_P1.3]  (value not drawn)
J22  BRESS_CI_D_7.62_01_FFKDSA1/V2  [BRESS_FFKDSA1/V2-7,62_P1.3]  (value not drawn)
J23  BRESS_CI_D_7.62_01_FFKDSA/V2  [BRESS_FFKDSA/V2-7,62_P1.3]  (value not drawn)
J25  BRESS_CI_D_7.62_01_FFKDSA1/V2  [BRESS_FFKDSA1/V2-7,62_P1.3]  (value not drawn)
J28  BRESS_CI_D_7.62_01_FFKDSA1/V2  [BRESS_FFKDSA1/V2-7,62_P1.3]  (value not drawn)
J31  BRESS_CI_D_7.62_01_FFKDSA1/V2  [BRESS_FFKDSA1/V2-7,62_P1.3]  (value not drawn)
J34  BRESS_CI_D_7.62_01_FFKDSA1/V2  [BRESS_FFKDSA1/V2-7,62_P1.3]  (value not drawn)
J37  BRESS_CI_D_7.62_01_FFKDSA1/V2  [BRESS_FFKDSA1/V2-7,62_P1.3]  (value not drawn)
J40  BRESS_CI_D_7.62_01_FFKDSA/V2  [BRESS_FFKDSA/V2-7,62_P1.3]  (value not drawn)
J42  BRESS_CI_D_7.62_01_FFKDSA1/V2  [BRESS_FFKDSA1/V2-7,62_P1.3]  (value not drawn)
J43  BRESS_CI_D_5.08_01_FFKDS/V2  [BRESS_FFKDS/V2-5,08_P1.3]  (value not drawn)
J45  BRESS_CI_D_5.08_01_FFKDS/V2  [BRESS_FFKDS/V2-5,08_P1.3]  (value not drawn)
J47  BRESS_CI_D_7.62_01_FFKDSA1/V2  [BRESS_FFKDSA1/V2-7,62_P1.3]  (value not drawn)
J48  BRESS_CI_D_7.62_01_FFKDSA/V2  [BRESS_FFKDSA/V2-7,62_P1.3]  (value not drawn)
J50  BRESS_CI_D_7.62_01_FFKDSA1/V2  [BRESS_FFKDSA1/V2-7,62_P1.3]  (value not drawn)
J53  BRESS_CI_D_7.62_01_FFKDSA1/V2  [BRESS_FFKDSA1/V2-7,62_P1.3]  (value not drawn)
J56  BRESS_CI_D_7.62_01_FFKDSA1/V2  [BRESS_FFKDSA1/V2-7,62_P1.3]  (value not drawn)
J59  BRESS_CI_D_7.62_01_FFKDSA/V2  [BRESS_FFKDSA/V2-7,62_P1.3]  (value not drawn)
J61  BRESS_CI_D_7.62_01_FFKDSA1/V2  [BRESS_FFKDSA1/V2-7,62_P1.3]  (value not drawn)
J62  BRESS_CI_D_5.08_01_FFKDS/V2  [BRESS_FFKDS/V2-5,08_P1.3]  (value not drawn)
J64  BRESS_CI_D_5.08_01_FFKDS/V2  [BRESS_FFKDS/V2-5,08_P1.3]  (value not drawn)
J66  BRESS_CI_D_7.62_01_FFKDSA1/V2  [BRESS_FFKDSA1/V2-7,62_P1.3]  (value not drawn)
J67  BRESS_CI_D_7.62_01_FFKDSA/V2  [BRESS_FFKDSA/V2-7,62_P1.3]  (value not drawn)
J69  BRESS_CI_D_7.62_01_FFKDSA1/V2  [BRESS_FFKDSA1/V2-7,62_P1.3]  (value not drawn)
J72  BRESS_CI_D_7.62_01_FFKDSA/V2  [BRESS_FFKDSA/V2-7,62_P1.3]  (value not drawn)
J74  BRESS_CI_D_7.62_01_FFKDSA1/V2  [BRESS_FFKDSA1/V2-7,62_P1.3]  (value not drawn)
J75  BRESS_CI_D_5.08_01_FFKDS/V2  [BRESS_FFKDS/V2-5,08_P1.3]  (value not drawn)
J77  BRESS_CI_D_5.08_01_FFKDS/V2  [BRESS_FFKDS/V2-5,08_P1.3]  (value not drawn)
J79  BRESS_CI_D_7.62_01_FFKDSA1/V2  [BRESS_FFKDSA1/V2-7,62_P1.3]  (value not drawn)
J80  BRESS_CI_D_5.08_01_FFKDS/V2  [BRESS_FFKDS/V2-5,08_P1.3]  (value not drawn)
J82  BRESS_CI_D_7.62_01_FFKDSA1/V2  [BRESS_FFKDSA1/V2-7,62_P1.3]  (value not drawn)
SUP_K1  RELAY-SUPPORT_93.11  [RELAY-SUPPORT_FINDER_SERIE93]  (value not drawn)
SUP_K2  RELAY-SUPPORT_93.11  [RELAY-SUPPORT_FINDER_SERIE93]  (value not drawn)
SUP_K3  RELAY-SUPPORT_93.11  [RELAY-SUPPORT_FINDER_SERIE93]  (value not drawn)
SUP_K4  RELAY-SUPPORT_95.15.2  [RELAY-SUPPORT_FINDER_SERIE95]  (value not drawn)
SUP_K5  RELAY-SUPPORT_95.15.2  [RELAY-SUPPORT_FINDER_SERIE95]  (value not drawn)
SUP_K6  RELAY-SUPPORT_95.15.2  [RELAY-SUPPORT_FINDER_SERIE95]  (value not drawn)
SUP_K7  RELAY-SUPPORT_95.15.2  [RELAY-SUPPORT_FINDER_SERIE95]  (value not drawn)
SUP_K8  RELAY-SUPPORT_95.15.2  [RELAY-SUPPORT_FINDER_SERIE95]  (value not drawn)
SUP_K9  RELAY-SUPPORT_95.15.2  [RELAY-SUPPORT_FINDER_SERIE95]  (value not drawn)
SUP_K10  RELAY-SUPPORT_95.15.2  [RELAY-SUPPORT_FINDER_SERIE95]  (value not drawn)
SUP_K11  RELAY-SUPPORT_95.15.2  [RELAY-SUPPORT_FINDER_SERIE95]  (value not drawn)
SUP_K12  RELAY-SUPPORT_95.15.2  [RELAY-SUPPORT_FINDER_SERIE95]  (value not drawn)
SUP_K13  RELAY-SUPPORT_95.15.2  [RELAY-SUPPORT_FINDER_SERIE95]  (value not drawn)
SUP_K14  RELAY-SUPPORT_95.15.2  [RELAY-SUPPORT_FINDER_SERIE95]  (value not drawn)
SUP_K15  RELAY-SUPPORT_95.15.2  [RELAY-SUPPORT_FINDER_SERIE95]  (value not drawn)
SUP_K16  RELAY-SUPPORT_93.11  [RELAY-SUPPORT_FINDER_SERIE93]  (value not drawn)
SUP_K17  RELAY-SUPPORT_93.11  [RELAY-SUPPORT_FINDER_SERIE93]  (value not drawn)
Title_new#8  DNI  (value not drawn)  (graphical)

### Ports
IN0 (out), IN1 (out), IN2 (out), IN3 (out), IN4 (out), IN5 (out), IN6 (out), IN7 (out), IN8 (out), IN9 (out), IN10 (out), IN11 (out), IN12 (out), IN13 (out), IN14 (out), IN15 (out), IN16 (out), IN17 (out), IN18 (out), IN19 (out), RB0CO (out), RB0NO (in), RB1CO (out), RB1NO (in), RB2CO (out), RB2NO (in), RB3CO (out), RB3NO (in), RB4CO (out), RB4NO (in), RB5CO (out), RB5NO (in), RB6CO (out), RB6NO (in), RB7CO (out), RB7NO (in), RB8CO (out), RB8NO (in), RB9CO (out), RB9NO (in), RB10CO (out), RB10NO (in), RB11CO (out), RB11NO (in), RM0CO (out), RM0NO (in), RM1CO (out), RM1NO (in), RM2CO (out), RM2NO (in), RM3CO (out), RM3NO (in), RM4CO (out), RM4NO (in), RV0IN (out), RV0OUT (in), RV1IN (out), RV1OUT (in), RV2IN (out), RV2OUT (in)

### Nets
GND: J3.1 J3.7 J3.13 J3.14 J3.19 J3.25
IN0: J3.2 ; port IN0
IN1: J3.3 ; port IN1
IN2: J3.4 ; port IN2
IN3: J3.5 ; port IN3
IN4: J3.6 ; port IN4
IN5: J3.8 ; port IN5
IN6: J3.9 ; port IN6
IN7: J3.10 ; port IN7
IN8: J3.11 ; port IN8
IN9: J3.12 ; port IN9
IN10: J3.15 ; port IN10
IN11: J3.16 ; port IN11
IN12: J3.17 ; port IN12
IN13: J3.18 ; port IN13
IN14: J3.20 ; port IN14
IN15: J3.21 ; port IN15
IN16: J3.22 ; port IN16
IN17: J3.23 ; port IN17
IN18: J3.24 ; port IN18
IN19: J3.26 ; port IN19
RB0CO: J22.1 J22.2 J23.1 J23.2 ; port RB0CO, port RB1CO, port RB2CO, port RB3CO, port RB4CO, port RB5CO
RB0NO: J25.1 J25.2 ; port RB0NO
RB1NO: J28.1 J28.2 ; port RB1NO
RB2NO: J31.1 J31.2 ; port RB2NO
RB3NO: J34.1 J34.2 ; port RB3NO
RB4NO: J37.1 J37.2 ; port RB4NO
RB5NO: J40.1 J40.2 ; port RB5NO
RB6CO: J47.1 J47.2 J48.1 J48.2 ; port RB6CO, port RB7CO, port RB8CO, port RB9CO
RB6NO: J50.1 J50.2 ; port RB6NO
RB7NO: J53.1 J53.2 ; port RB7NO
RB8NO: J56.1 J56.2 ; port RB8NO
RB9NO: J59.1 J59.2 ; port RB9NO
RB10CO: J66.1 J66.2 J67.1 J67.2 ; port RB10CO, port RB11CO
RB10NO: J69.1 J69.2 ; port RB10NO
RB11NO: J72.1 J72.2 ; port RB11NO
RM0CO: J4.1 J4.2 J5.1 J5.2 ; port RM0CO
RM0NO: J7.1 J7.2 ; port RM0NO
RM1CO: J14.1 J14.2 J15.1 J15.2 ; port RM1CO, port RM2CO
RM1NO: J17.1 J17.2 ; port RM1NO
RM2NO: J20.1 J20.2 ; port RM2NO
RM3CO: J74.1 J74.2 J75.1 J75.2 ; port RM3CO
RM3NO: J77.1 J77.2 ; port RM3NO
RM4CO: J79.1 J79.2 J80.1 J80.2 ; port RM4CO
RM4NO: J82.1 J82.2 ; port RM4NO
RV0IN: J9.1 J9.2 J10.1 J10.2 ; port RV0IN
RV0OUT: J12.1 J12.2 ; port RV0OUT
RV1IN: J42.1 J42.2 J43.1 J43.2 ; port RV1IN
RV1OUT: J45.1 J45.2 ; port RV1OUT
RV2IN: J61.1 J61.2 J62.1 J62.2 ; port RV2IN
RV2OUT: J64.1 J64.2 ; port RV2OUT

### Layout directives
net class BT: (no net found under the mark)

### Notes on the sheet
- Entrée
- Salon
- Salle à Manger
- Bureau
- Dressing
- VARIATEUR
- Borniers
- (in symbol Title_new) Sheet Size:; Carte Boîtier Auxiliaire; A3; "Pièces de vie"; Print Date:; [No Variations]; Page:; /; EDA: ALtium Desingner 16; Rev. D

### Library data of the parts
J3 = Header 13X2: 26 Positions Header, Shrouded Connector 0.100" (2.54mm) Through Hole Gold; Manufacturer: Wurth Electronics Inc; Fabricant: Wurth Elektronik; Supplier 1: Digi-Key; Supplier Part Number 1: 732-2097-ND; Manufacturer Part Number: 61202621621; Ref Fab: 61202621621
J4 J9 J14 J17 J22 J25 J28 J31 J34 J37 J42 J47 J50 J53 J56 J61 J66 J69 J74 J79 J82 = BRESS_CI_D_7.62_01_FFKDSA1/V2: Bornier à connexion par ressorts/déconnexion par levier, série FFKDSA1/V2, e7.62, 1x1pts, droit, juxtaposable, 500V/17.5A, AWG22~16, Vert/Orange; Creation: LJ (21/11/11); Boitier: 7.62x10_h15.8_e7.62_p1.3mm; Remarque: {Remarque}; Fabricant: Phoenix Contact; Ref Fab: 1790487; Coeff: 1; Value: FFKDSA1/V2-7,62; Verification: *; ComponentLink1URL: o:\_Documentation\Datasheets\Phoenix\FFKDSA1-V2_7,62_1790487.pdf; ComponentLink2URL: o:\_Documentation\Datasheets\_BOITIERS\; Config: *; ComponentLink1Description: Datasheet; ComponentLink2Description: Datasheet
J5 J7 J10 J12 J15 J20 J43 J45 J62 J64 J75 J77 J80 = BRESS_CI_D_5.08_01_FFKDS/V2: Bornier à connexion par ressorts/déconnexion par levier, série FFKDS/V2, e5.08, 1x1pts, droit, juxtaposable, 320V/15A, AWG22~16, Vert/Orange; Creation: LJ (21/11/11); Boitier: 5.08x10_h15.8_e5.08_p1.3mm; Remarque: {Remarque}; Fabricant: Phoenix Contact; Ref Fab: 1790348; Coeff: 1; Value: FFKDS/V2-5,08; Verification: *; ComponentLink1URL: o:\_Documentation\Datasheets\Phoenix\FFKDS-V2_5,08_1790348.pdf; ComponentLink2URL: o:\_Documentation\Datasheets\_BOITIERS\; Config: *; ComponentLink1Description: Datasheet; ComponentLink2Description: Datasheet
J23 J40 J48 J59 J67 J72 = BRESS_CI_D_7.62_01_FFKDSA/V2: Bornier à connexion par ressorts/déconnexion par levier, série FFKDSA/V2, e7.62, 1x1pts, droit, juxtaposable, 500V/17.5A, AWG22~16, Vert/Orange; Creation: LJ (21/11/11); Boitier: 7.62x10_h15.8_e7.62_p1.3mm; Remarque: {Remarque}; Fabricant: Phoenix Contact; Ref Fab: 1790377; Coeff: 1; Value: FFKDSA/V2-7,62; Verification: *; ComponentLink1URL: o:\_Documentation\Datasheets\Phoenix\FFKDSA-V2_7,62_1790377.pdf; ComponentLink2URL: o:\_Documentation\Datasheets\_BOITIERS\; Config: *; ComponentLink1Description: Datasheet; ComponentLink2Description: Datasheet
SUP_K1-SUP_K3 SUP_K16 SUP_K17 = RELAY-SUPPORT_93.11: Suppor série 93 pour relais Finder séries 34, 250V/6A, Bleu; Creation: LJ (24/11/11); Remarque: {Remarque}; Ref Fab: 93.11; Coeff: 1; Value: 93.11; Fabricant: Finder; ComponentLink1URL: o:\_Documentation\Datasheets\Finder\Relais_Serie_34.pdf; ComponentLink2URL: o:\_Documentation\Datasheets\; Config: *; ComponentLink1Description: Datasheet; ComponentLink2Description: Datasheet Boitier
SUP_K4-SUP_K15 = RELAY-SUPPORT_95.15.2: Suppor série 95 pour relais Finder séries 40, 250V/10A, Bleu, sans Etrier; Creation: LJ (11/06/12); Remarque: {Remarque}; Coeff: 1; Fabricant: Finder; Ref Fab: 95.15.2; ComponentLink1URL: o:\_Documentation\Datasheets\Finder\Relais_Serie_40.pdf; ComponentLink2URL: o:\_Documentation\Datasheets\; Config: *; ComponentLink1Description: Datasheet; ComponentLink2Description: Datasheet Boitier; Value: 95.15.2
Title_new#8 = Title_new

## Nets that join several sheets
+5V: SC940D_Coeur (17 pins), SC940D_Variateurs (6 pins), SC940D_STORRB (R45.2 R46.2)
+12V: SC940D_Coeur (6 pins), SC940D_ETOR1 (12 pins), SC940D_ETOR2 (8 pins), SC940D_STORRM (10 pins), SC940D_STORRB (15 pins)
GND: SC940D_Coeur (30 pins), SC940D_ETOR1 (36 pins), SC940D_ETOR2 (24 pins), SC940D_STORRM (10 pins), SC940D_Variateurs (6 pins), SC940D_STORRB (C38.2 C39.1 U6.3), SC940D_Borniers (6 pins)
IN0: SC940D_ETOR1 (D10.K R9.1 R10.1 R11.2), SC940D_Borniers (J3.2)
IN0_UC: SC940D_Coeur (U4.15), SC940D_ETOR1 (C6.2 R10.2)
IN1: SC940D_ETOR1 (D13.K R15.1 R16.1 R17.2), SC940D_Borniers (J3.3)
IN1_UC: SC940D_Coeur (U4.14), SC940D_ETOR1 (C8.2 R15.2)
IN2: SC940D_ETOR1 (D16.K R21.1 R22.1 R23.2), SC940D_Borniers (J3.4)
IN2_UC: SC940D_Coeur (U4.13), SC940D_ETOR1 (C10.2 R22.2)
IN3: SC940D_ETOR1 (D18.K R27.1 R28.1 R29.2), SC940D_Borniers (J3.5)
IN3_UC: SC940D_Coeur (U4.12), SC940D_ETOR1 (C12.2 R28.2)
IN4: SC940D_ETOR1 (D21.K R33.1 R34.1 R35.2), SC940D_Borniers (J3.6)
IN4_UC: SC940D_Coeur (U4.11), SC940D_ETOR1 (C14.2 R33.2)
IN5: SC940D_ETOR1 (D12.K R12.1 R13.1 R14.2), SC940D_Borniers (J3.8)
IN5_UC: SC940D_Coeur (U4.8), SC940D_ETOR1 (C7.2 R13.2)
IN6: SC940D_ETOR1 (D14.K R18.1 R19.1 R20.2), SC940D_Borniers (J3.9)
IN6_UC: SC940D_Coeur (U4.7), SC940D_ETOR1 (C9.2 R19.2)
IN7: SC940D_ETOR1 (D17.K R24.1 R25.1 R26.2), SC940D_Borniers (J3.10)
IN7_UC: SC940D_Coeur (U4.6), SC940D_ETOR1 (C11.2 R25.2)
IN8: SC940D_ETOR1 (D20.K R30.1 R31.1 R32.2), SC940D_Borniers (J3.11)
IN8_UC: SC940D_Coeur (U4.5), SC940D_ETOR1 (C13.2 R30.2)
IN9: SC940D_ETOR1 (D22.K R36.1 R37.1 R38.2), SC940D_Borniers (J3.12)
IN9_UC: SC940D_Coeur (U4.4), SC940D_ETOR1 (C15.2 R37.2)
IN10: SC940D_ETOR1 (D26.K R42.1 R43.2 R44.1), SC940D_Borniers (J3.15)
IN10_UC: SC940D_Coeur (U4.3), SC940D_ETOR1 (C26.2 R42.2)
IN11: SC940D_ETOR1 (D28.K R47.1 R48.2 R49.1), SC940D_Borniers (J3.16)
IN11_UC: SC940D_Coeur (U4.2), SC940D_ETOR1 (C28.2 R47.2)
IN12: SC940D_ETOR2 (D30.K R50.1 R51.2 R52.1), SC940D_Borniers (J3.17)
IN12_UC: SC940D_Coeur (U4.1), SC940D_ETOR2 (C29.2 R50.2)
IN13: SC940D_ETOR2 (D32.K R53.1 R54.2 R55.1), SC940D_Borniers (J3.18)
IN13_UC: SC940D_Coeur (U4.64), SC940D_ETOR2 (C30.2 R53.2)
IN14: SC940D_ETOR2 (D33.K R56.1 R57.2 R58.1), SC940D_Borniers (J3.20)
IN14_UC: SC940D_Coeur (U4.63), SC940D_ETOR2 (C31.2 R56.2)
IN15: SC940D_ETOR2 (D35.K R59.1 R60.2 R61.1), SC940D_Borniers (J3.21)
IN15_UC: SC940D_Coeur (U4.60), SC940D_ETOR2 (C32.2 R59.2)
IN16: SC940D_ETOR2 (D36.K R62.1 R63.2 R64.1), SC940D_Borniers (J3.22)
IN16_UC: SC940D_Coeur (U4.59), SC940D_ETOR2 (C33.2 R62.2)
IN17: SC940D_ETOR2 (D38.K R65.1 R66.2 R67.1), SC940D_Borniers (J3.23)
IN17_UC: SC940D_Coeur (U4.53), SC940D_ETOR2 (C35.2 R65.2)
IN18: SC940D_ETOR2 (D40.K R68.1 R69.2 R70.1), SC940D_Borniers (J3.24)
IN18_UC: SC940D_Coeur (U4.52), SC940D_ETOR2 (C36.2 R68.2)
IN19: SC940D_ETOR2 (D41.K R71.1 R72.2 R73.1), SC940D_Borniers (J3.26)
IN19_UC: SC940D_Coeur (U4.51), SC940D_ETOR2 (C37.2 R71.2)
RB0_UC: SC940D_Coeur (U4.30), SC940D_STORRB (T4.1 T5.1)
RB0CO: SC940D_STORRB (12 pins), SC940D_Borniers (J22.1 J22.2 J23.1 J23.2)
RB0NO: SC940D_STORRB (K4.14 K4.24), SC940D_Borniers (J25.1 J25.2)
RB1_UC: SC940D_Coeur (U4.31), SC940D_STORRB (T6.1 T7.1)
RB1NO: SC940D_STORRB (K5.14 K5.24), SC940D_Borniers (J28.1 J28.2)
RB2_UC: SC940D_Coeur (U4.32), SC940D_STORRB (T8.1 T9.1)
RB2NO: SC940D_STORRB (K6.14 K6.24), SC940D_Borniers (J31.1 J31.2)
RB3_UC: SC940D_Coeur (U4.33), SC940D_STORRB (T10.1 T11.1)
RB3NO: SC940D_STORRB (K7.14 K7.24), SC940D_Borniers (J34.1 J34.2)
RB4_UC: SC940D_Coeur (U4.34), SC940D_STORRB (T12.1 T13.1)
RB4NO: SC940D_STORRB (K8.14 K8.24), SC940D_Borniers (J37.1 J37.2)
RB5_UC: SC940D_Coeur (U4.35), SC940D_STORRB (T14.1 T15.1)
RB5NO: SC940D_STORRB (K9.14 K9.24), SC940D_Borniers (J40.1 J40.2)
RB6_UC: SC940D_Coeur (U4.37), SC940D_STORRB (T16.1 T17.1)
RB6CO: SC940D_STORRB (8 pins), SC940D_Borniers (J47.1 J47.2 J48.1 J48.2)
RB6NO: SC940D_STORRB (K10.14 K10.24), SC940D_Borniers (J50.1 J50.2)
RB7_UC: SC940D_Coeur (U4.44), SC940D_STORRB (T18.1 T19.1)
RB7NO: SC940D_STORRB (K11.14 K11.24), SC940D_Borniers (J53.1 J53.2)
RB8_UC: SC940D_Coeur (U4.45), SC940D_STORRB (T20.1 T21.1)
RB8NO: SC940D_STORRB (K12.14 K12.24), SC940D_Borniers (J56.1 J56.2)
RB9_UC: SC940D_Coeur (U4.46), SC940D_STORRB (T22.1 T23.1)
RB9NO: SC940D_STORRB (K13.14 K13.24), SC940D_Borniers (J59.1 J59.2)
RB10_UC: SC940D_Coeur (U4.47), SC940D_STORRB (T24.1 T25.1)
RB10CO: SC940D_STORRB (K14.11 K14.21 K15.11 K15.21), SC940D_Borniers (J66.1 J66.2 J67.1 J67.2)
RB10NO: SC940D_STORRB (K14.14 K14.24), SC940D_Borniers (J69.1 J69.2)
RB11_UC: SC940D_Coeur (U4.50), SC940D_STORRB (T26.1 T27.1)
RB11NO: SC940D_STORRB (K15.14 K15.24), SC940D_Borniers (J72.1 J72.2)
RBSENS1_UC: SC940D_Coeur (U4.55), SC940D_STORRB (R45.1 U6.2)
RBSENS2_UC: SC940D_Coeur (U4.54), SC940D_STORRB (R46.1 U6.4)
RM0_UC: SC940D_Coeur (U4.27), SC940D_STORRM (R6.2 T1.1)
RM0CO: SC940D_STORRM (K1.11), SC940D_Borniers (J4.1 J4.2 J5.1 J5.2)
RM0NO: SC940D_STORRM (K1.14), SC940D_Borniers (J7.1 J7.2)
RM1_UC: SC940D_Coeur (U4.28), SC940D_STORRM (R7.2 T2.1)
RM1CO: SC940D_STORRM (K2.11 K3.11), SC940D_Borniers (J14.1 J14.2 J15.1 J15.2)
RM1NO: SC940D_STORRM (K2.14), SC940D_Borniers (J17.1 J17.2)
RM2_UC: SC940D_Coeur (U4.29), SC940D_STORRM (R8.2 T3.1)
RM2NO: SC940D_STORRM (K3.14), SC940D_Borniers (J20.1 J20.2)
RM3_UC: SC940D_Coeur (U4.42), SC940D_STORRM (R74.2 T28.1)
RM3CO: SC940D_STORRM (K16.11), SC940D_Borniers (J74.1 J74.2 J75.1 J75.2)
RM3NO: SC940D_STORRM (K16.14), SC940D_Borniers (J77.1 J77.2)
RM4_UC: SC940D_Coeur (U4.43), SC940D_STORRM (R75.2 T29.1)
RM4CO: SC940D_STORRM (K17.11), SC940D_Borniers (J79.1 J79.2 J80.1 J80.2)
RM4NO: SC940D_STORRM (K17.14), SC940D_Borniers (J82.1 J82.2)
RV0_UC: SC940D_Coeur (U4.21), SC940D_Variateurs (U2.2UC)
RV0IN: SC940D_Variateurs (U2.1TR U2.2TR VR1.2), SC940D_Borniers (J9.1 J9.2 J10.1 J10.2)
RV0OUT: SC940D_Variateurs (U2.3TR U2.4TR VR1.1), SC940D_Borniers (J12.1 J12.2)
RV1_UC: SC940D_Coeur (U4.48), SC940D_Variateurs (U5.2UC)
RV1IN: SC940D_Variateurs (U5.1TR U5.2TR VR2.2), SC940D_Borniers (J42.1 J42.2 J43.1 J43.2)
RV1OUT: SC940D_Variateurs (U5.3TR U5.4TR VR2.1), SC940D_Borniers (J45.1 J45.2)
RV2_UC: SC940D_Coeur (U4.49), SC940D_Variateurs (U7.2UC)
RV2IN: SC940D_Variateurs (U7.1TR U7.2TR VR3.2), SC940D_Borniers (J61.1 J61.2 J62.1 J62.2)
RV2OUT: SC940D_Variateurs (U7.3TR U7.4TR VR3.1), SC940D_Borniers (J64.1 J64.2)

## Assembly variants
SC940-0C: not fitted C23 C25